# Altium schematic sheet Microcontroller.SchDoc: Microcontroller
size A4; SheetNumber: 4; SheetTotal: 7
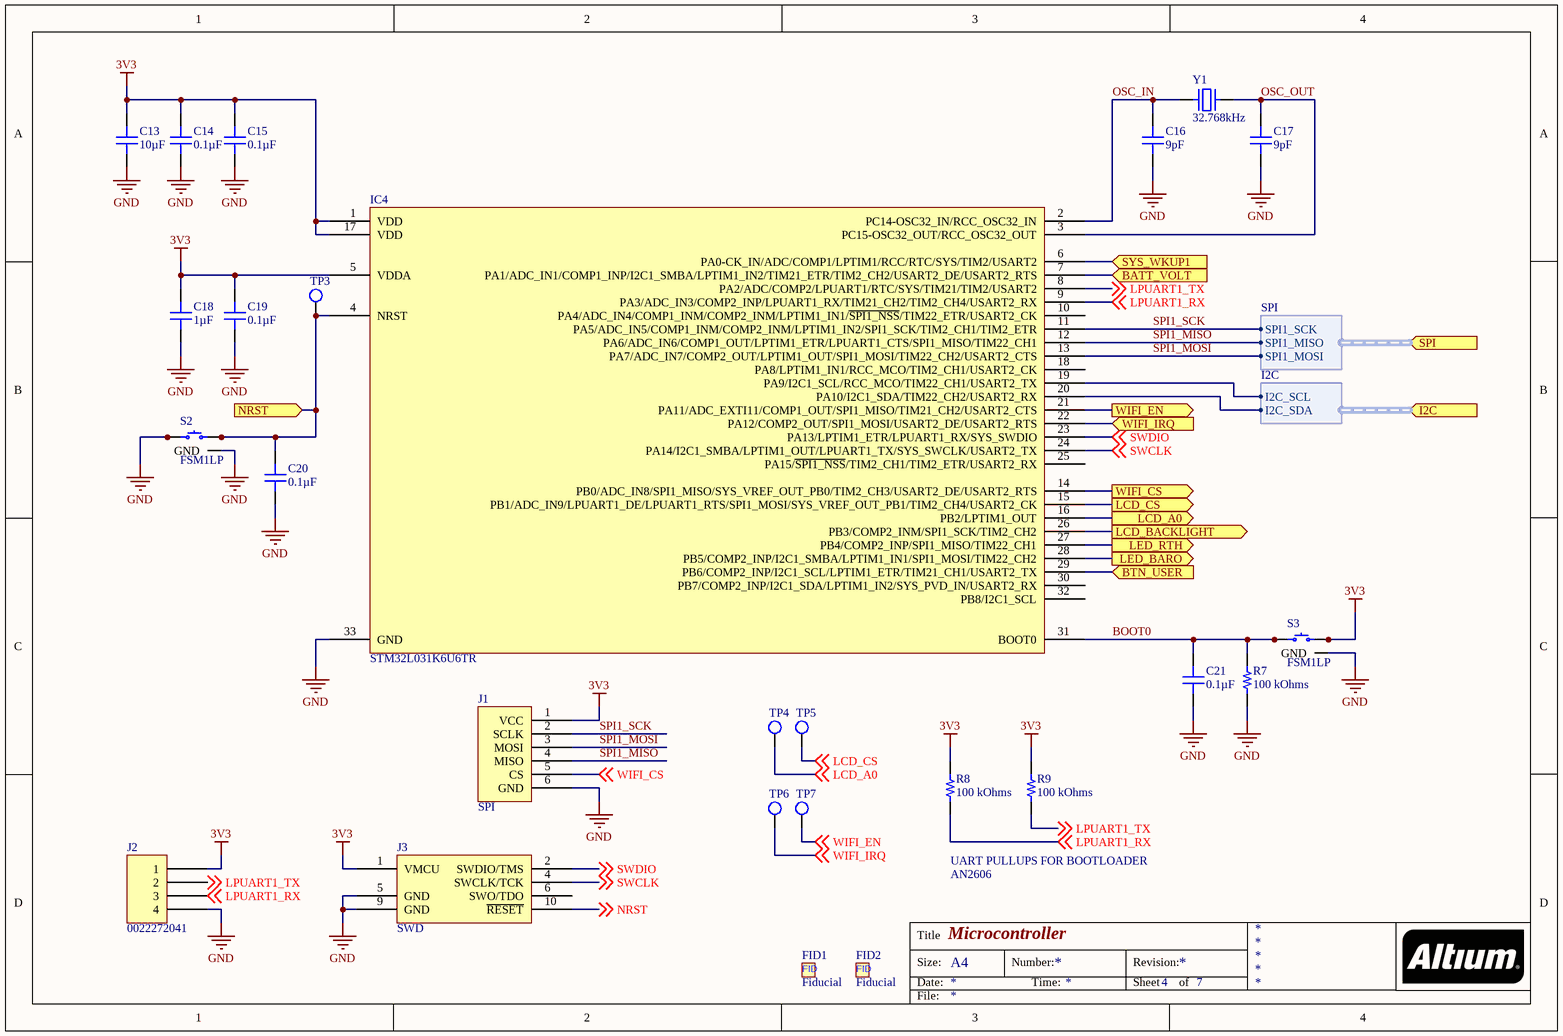
[diagram p0: Microcontroller.SchDoc]

## Parts
C13  10µF  [CAP 0805_2012]
C14  0.1µF  [CAP 0603_1608]
C15  0.1µF  [CAP 0603_1608]
C16  9pF  [CAP 0603_1608]
C17  9pF  [CAP 0603_1608]
C18  1µF  [CAP 0603_1608]
C19  0.1µF  [CAP 0603_1608]
C20  0.1µF  [CAP 0603_1608]
C21  0.1µF  [CAP 0603_1608]
FID1  Fiducial  [Fiducial-1mm]
FID2  Fiducial  [Fiducial-1mm]
IC4  STM32L031K6U6TR  [ST UFQFPN32 5x5MM]
J1  SPI  [SPI Breakout]
J2  0022272041  [MOLEX KK 0022272041]
J3  SWD  [10 Pin SWD]  (no BOM)
R7  100 kOhms  [RES 0603_1608]
R8  100 kOhms  [RES 0603_1608]
R9  100 kOhms  [RES 0603_1608]
S2  FSM1LP  [TE FSM1LPATR]
S3  FSM1LP  [TE FSM1LPATR]
TP3  Test Point  [TestPoint-1.5mm]  (value not drawn)  (no BOM)
TP4  Test Point  [TestPoint-1.5mm]  (value not drawn)  (no BOM)
TP5  Test Point  [TestPoint-1.5mm]  (value not drawn)  (no BOM)
TP6  Test Point  [TestPoint-1.5mm]  (value not drawn)  (no BOM)
TP7  Test Point  [TestPoint-1.5mm]  (value not drawn)  (no BOM)
Y1  32.768kHz  [ABRACON ABS07]

## Ports
BATT_VOLT (in), BTN_USER (in), I2C (in, harness I2C), LCD_A0 (out), LCD_BACKLIGHT (out), LCD_CS (out), LED_BARO (out), LED_RTH (out), NRST (in), SPI (in, harness SPI), SYS_WKUP1 (in), WIFI_CS (out), WIFI_EN (out), WIFI_IRQ (in)

## Harnesses
SPI: SPI1_MISO, SPI1_MOSI, SPI1_SCK
I2C: I2C_SDA, I2C_SCL

## Nets
3V3: C13.2 C14.2 C15.2 C18.2 C19.2 IC4.1(VDD) IC4.5(VDDA) IC4.17(VDD) J1.1(VCC) J2.1 J3.1(VMCU) R8.2 R9.2 S3.3 S3.4
GND: C13.1 C14.1 C15.1 C16.1 C17.1 C18.1 C19.1 C20.1 C21.1 IC4.33(GND) J1.6(GND) J2.4 J3.5(GND) J3.9(GND) R7.1 S2.1 S2.2 S2.5(GND) S3.5(GND)
BATT_VOLT: IC4.7(PA1/ADC_IN1/COMP1_INP/I2C1_SMBA/LPTIM1_IN2/TIM21_ETR/TIM2_CH2/USART2_DE/USART2_RTS) ; port BATT_VOLT
BOOT0: C21.2 IC4.31(BOOT0) R7.2 S3.1 S3.2
BTN_USER: IC4.29(PB6/COMP2_INP/I2C1_SCL/LPTIM1_ETR/TIM21_CH1/USART2_TX) ; port BTN_USER
LCD_A0: IC4.16(PB2/LPTIM1_OUT) ; port LCD_A0
LCD_A0: TP4.1(TP) ; off-sheet LCD_A0  [a separate net that carries the same name]
LCD_BACKLIGHT: IC4.26(PB3/COMP2_INM/SPI1_SCK/TIM2_CH2) ; port LCD_BACKLIGHT
LCD_CS: IC4.15(PB1/ADC_IN9/LPUART1_DE/LPUART1_RTS/SPI1_MOSI/SYS_VREF_OUT_PB1/TIM2_CH4/USART2_CK) ; port LCD_CS
LCD_CS: TP5.1(TP) ; off-sheet LCD_CS  [a separate net that carries the same name]
LED_BARO: IC4.28(PB5/COMP2_INP/I2C1_SMBA/LPTIM1_IN1/SPI1_MOSI/TIM22_CH2) ; port LED_BARO
LED_RTH: IC4.27(PB4/COMP2_INP/SPI1_MISO/TIM22_CH1) ; port LED_RTH
LPUART1_RX: IC4.9(PA3/ADC_IN3/COMP2_INP/LPUART1_RX/TIM21_CH2/TIM2_CH4/USART2_RX) J2.3 R8.1 ; off-sheet LPUART1_RX
LPUART1_TX: IC4.8(PA2/ADC/COMP2/LPUART1/RTC/SYS/TIM21/TIM2/USART2) J2.2 R9.1 ; off-sheet LPUART1_TX
NRST: C20.2 IC4.4(NRST) S2.3 S2.4 TP3.1(TP) ; port NRST
NRST: J3.10(~{RESET}) ; off-sheet NRST  [a separate net that carries the same name]
OSC_IN: C16.2 IC4.2(PC14-OSC32_IN/RCC_OSC32_IN) Y1.1
OSC_OUT: C17.2 IC4.3(PC15-OSC32_OUT/RCC_OSC32_OUT) Y1.2
SPI1_MISO: IC4.12(PA6/ADC_IN6/COMP1_OUT/LPTIM1_ETR/LPUART1_CTS/SPI1_MISO/TIM22_CH1) J1.4(MISO) ; port SPI.SPI1_MISO
SPI1_MOSI: IC4.13(PA7/ADC_IN7/COMP2_OUT/LPTIM1_OUT/SPI1_MOSI/TIM22_CH2/USART2_CTS) J1.3(MOSI) ; port SPI.SPI1_MOSI
SPI1_SCK: IC4.11(PA5/ADC_IN5/COMP1_INM/COMP2_INM/LPTIM1_IN2/SPI1_SCK/TIM2_CH1/TIM2_ETR) J1.2(SCLK) ; port SPI.SPI1_SCK
SWCLK: IC4.24(PA14/I2C1_SMBA/LPTIM1_OUT/LPUART1_TX/SYS_SWCLK/USART2_TX) J3.4(SWCLK/TCK) ; off-sheet SWCLK
SWDIO: IC4.23(PA13/LPTIM1_ETR/LPUART1_RX/SYS_SWDIO) J3.2(SWDIO/TMS) ; off-sheet SWDIO
SYS_WKUP1: IC4.6(PA0-CK_IN/ADC/COMP1/LPTIM1/RCC/RTC/SYS/TIM2/USART2) ; port SYS_WKUP1
WIFI_CS: IC4.14(PB0/ADC_IN8/SPI1_MISO/SYS_VREF_OUT_PB0/TIM2_CH3/USART2_DE/USART2_RTS) ; port WIFI_CS
WIFI_CS: J1.5(CS) ; off-sheet WIFI_CS  [a separate net that carries the same name]
WIFI_EN: IC4.21(PA11/ADC_EXTI11/COMP1_OUT/SPI1_MISO/TIM21_CH2/USART2_CTS) ; port WIFI_EN
WIFI_EN: TP7.1(TP) ; off-sheet WIFI_EN  [a separate net that carries the same name]
WIFI_IRQ: IC4.22(PA12/COMP2_OUT/SPI1_MOSI/USART2_DE/USART2_RTS) ; port WIFI_IRQ
WIFI_IRQ: TP6.1(TP) ; off-sheet WIFI_IRQ  [a separate net that carries the same name]
NetIC4_19: IC4.19(PA9/I2C1_SCL/RCC_MCO/TIM22_CH1/USART2_TX) ; port I2C.I2C_SCL
NetIC4_20: IC4.20(PA10/I2C1_SDA/TIM22_CH2/USART2_RX) ; port I2C.I2C_SDA

Not connected (* = marked no-connect by the designer): IC4 10(PA4/ADC_IN4/COMP1_INM/COMP2_INM/LPTIM1_IN1/~{SPI1_NSS}/TIM22_ETR/USART2_CK) 18(PA8/LPTIM1_IN1/RCC_MCO/TIM2_CH1/USART2_CK) 25(PA15/~{SPI1_NSS}/TIM2_CH1/TIM2_ETR/USART2_RX) 30(PB7/COMP2_INP/I2C1_SDA/LPTIM1_IN2/SYS_PVD_IN/USART2_RX) 32(PB8/I2C1_SCL); J3 6(SWO/TDO)

## Notes on the sheet
- UART PULLUPS FOR BOOTLOADER
- AN2606
- Title
- Size:
- Date:
- A4
- Number:
- Time:
- Revision:
- Sheet
- of
- File:
- (in symbol Fiducial) FID

## Library data of the parts
C13 = CL21A106KPCLQNC: CAP CER 10UF 10V X5R 0805; Manufacturer: Samsung Electro-Mechanics; Tolerance: ±10%; Part Number: CL21A106KPCLQNC; Value: 10µF; Applications: General Purpose; Capacitance: 10µF; ComponentLink1Description: Datasheet; ComponentLink1URL: http://www.samsungsem.com/kr/support/product-search/mlcc/CL21A106KPCLQNC.jsp; ComponentLink2Description: DigiKey Link; ComponentLink2URL: http://digikey.com/product-detail/en/samsung-electro-mechanics/CL21A106KPCLQNC/1276-2402-1-ND/3890488; Device Package: 0805 (2012 Metric); LastUpdated: 02/09/2020 01:04:19; Lifecycle Status: Active; Minimum Order: 1; Mounting Type: Surface Mount, MLCC; Operating Temperature: -55°C ~ 85°C; Package / Case: 0805 (2012 Metric); Packaging: TapeAndReel; PartId: 14319; Part Status: Active; Price: 0.03; Series: CL; Size / Dimension: 0.079" L x 0.049" W (2.00mm x 1.25mm); Supplier 1: DigiKey; Supplier Part Number 1: 1276-2402-1-ND; Temperature Coefficient: X5R; Thickness (Max): 0.037" (0.95mm); Voltage - Rated: 10V
C14 C15 C19-C21 = 06035C104JAT4A: CAP CER 0.1UF 50V X7R 0603; Manufacturer: AVX Corporation; Tolerance: ±5%; Part Number: 06035C104JAT4A; Value: 0.1µF; Applications: General Purpose; Capacitance: 0.1µF; ComponentLink1Description: Datasheet; ComponentLink1URL: http://datasheets.avx.com/X7RDielectric.pdf; ComponentLink2Description: DigiKey Link; ComponentLink2URL: http://digikey.com/product-detail/en/avx-corporation/06035C104JAT4A/478-12459-1-ND/9749311; Device Package: 0603 (1608 Metric); LastUpdated: 02/09/2020 01:03:34; Lifecycle Status: Active; Minimum Order: 1; Mounting Type: Surface Mount, MLCC; Operating Temperature: -55°C ~ 125°C; Package / Case: 0603 (1608 Metric); Packaging: TapeAndReel; PartId: 3002; Part Status: Active; Price: 0.01; Series: -; Size / Dimension: 0.063" L x 0.032" W (1.60mm x 0.81mm); Supplier 1: DigiKey; Supplier Part Number 1: 478-12459-1-ND; Temperature Coefficient: X7R; Thickness (Max): 0.035" (0.90mm); Voltage - Rated: 50V
C16 C17 = CL10C090CB8NNNC: CAP CER 9PF 50V C0G/NP0 0603; Manufacturer: Samsung Electro-Mechanics; Temperature Coefficient: C0G, NP0; Tolerance: ±0.25pF; Part Number: CL10C090CB8NNNC; Value: 9pF; Applications: General Purpose; Capacitance: 9pF; ComponentLink1Description: Datasheet; ComponentLink1URL: http://www.samsungsem.com/kr/support/product-search/mlcc/CL10C090CB8NNNC.jsp; ComponentLink2Description: DigiKey Link; ComponentLink2URL: http://digikey.com/product-detail/en/samsung-electro-mechanics/CL10C090CB8NNNC/1276-2142-1-ND/3890228; Device Package: 0603 (1608 Metric); LastUpdated: 02/09/2020 01:03:13; Lifecycle Status: Active; Minimum Order: 1; Mounting Type: Surface Mount, MLCC; Operating Temperature: -55°C ~ 125°C; Package / Case: 0603 (1608 Metric); Packaging: TapeAndReel; PartId: 14182; Part Status: Active; Price: 0.01; Series: CL; Size / Dimension: 0.063" L x 0.031" W (1.60mm x 0.80mm); Supplier 1: DigiKey; Supplier Part Number 1: 1276-2142-1-ND; Thickness (Max): 0.035" (0.90mm); Voltage - Rated: 50V
C18 = LMK107B7105KA-T: CAP CER 1UF 10V X7R 0603; Manufacturer: Taiyo Yuden; Tolerance: ±10%; Part Number: LMK107B7105KA-T; Value: 1µF; Applications: General Purpose; Capacitance: 1µF; ComponentLink1Description: Datasheet; ComponentLink1URL: https://www.yuden.co.jp/productdata/catalog/mlcc01_e.pdf; ComponentLink2Description: DigiKey Link; ComponentLink2URL: http://digikey.com/product-detail/en/taiyo-yuden/LMK107B7105KA-T/587-1242-1-ND/931019; Device Package: 0603 (1608 Metric); LastUpdated: 02/09/2020 01:03:30; Lifecycle Status: Active; Minimum Order: 1; Mounting Type: Surface Mount, MLCC; Operating Temperature: -55°C ~ 125°C; Package / Case: 0603 (1608 Metric); Packaging: TapeAndReel; PartId: 5525; Part Status: Active; Price: 0.01; Series: M; Size / Dimension: 0.063" L x 0.031" W (1.60mm x 0.80mm); Supplier 1: DigiKey; Supplier Part Number 1: 587-1242-1-ND; Temperature Coefficient: X7R; Thickness (Max): 0.035" (0.90mm); Voltage - Rated: 10V
IC4 = STM32L031K6U6TR: IC MCU 32BIT 32KB FLASH 32UFQFPN; Manufacturer: STMicroelectronics; Connectivity: I²C, IrDA, LINbus, SPI, UART/USART; Core Processor: ARM® Cortex®-M0+; Core Size: 32-Bit; Data Converters: A/D 10x12b; EEPROM Size: 1K x 8; Number of I/O: 27; Oscillator Type: Internal; Peripherals: Brown-out Detect/Reset, DMA, POR, PWM, WDT; Program Memory Size: 32KB (32K x 8); RAM Size: 8K x 8; Speed: 32MHz; Voltage - Supply (Vcc/Vdd): 1.8V ~ 3.6V; Part Number: STM32L031K6U6TR; ComponentLink1Description: Datasheet; ComponentLink1URL: http://www.st.com/content/ccc/resource/technical/document/datasheet/aa/5d/77/ad/1a/59/4a/b9/DM00140359.pdf/files/DM00140359.pdf/jcr:content/translations/en.DM00140359.pdf; ComponentLink2Description: DigiKey Link; ComponentLink2URL: http://digikey.com/product-detail/en/stmicroelectronics/STM32L031K6U6TR/497-18807-1-ND/9958467; LastUpdated: 18/01/2022 11:56:57; Lifecycle Status: Active; Minimum Order: 1; Mounting Type: Surface Mount; Operating Temperature: -40°C ~ 85°C (TA); Package / Case: 32-UFQFN Exposed Pad; Packaging: TapeAndReel; PartId: 225; Part Status: Active; Price: 1.15; Program Memory Type: FLASH; Series: STM32L0; Supplier 1: DigiKey; Supplier Part Number 1: 497-18807-1-ND; Supplier Device Package: 32-UFQFPN (5x5)
J2 = 0022272041: CONN HEADER VERT 4POS 2.54MM; Manufacturer: Molex; Contact Length - Mating: 0.295" (7.49mm); Contact Length - Post: 0.140" (3.56mm); Material Flammability Rating: UL94 V-0; Number of Positions: 4; Number of Positions Loaded: All; Overall Contact Length: 0.560" (14.22mm); Pitch - Mating: 0.100" (2.54mm); Shrouding: Shrouded - 1 Wall; Style: Board to Cable/Wire; Part Number: 0022272041; ComponentLink1Description: Datasheet; ComponentLink1URL: https://www.molex.com/pdm_docs/sd/022272041_sd.pdf; ComponentLink2Description: DigiKey Link; ComponentLink2URL: http://digikey.com/product-detail/en/molex/0022272041/WM4113-ND/1130579; Connector Type: Header; Contact Finish - Mating: Tin; Contact Finish - Post: Tin; Contact Finish Thickness - Mating: 100.0µin (2.54µm); Contact Material: Brass; Contact Shape: Square; Contact Type: Male Pin; Fastening Type: Friction Lock; Insulation Color: Natural; Insulation Height: 0.461" (11.70mm); Insulation Material: Polyamide (PA), Nylon; LastUpdated: 12/01/2020 23:52:05; Lifecycle Status: Active; Minimum Order: 1; Mounting Type: Through Hole; Number of Rows: 1; Packaging: Bulk; PartId: 78; Part Status: Active; Price: 0.40; Series: KK 6410; Supplier 1: DigiKey; Supplier Part Number 1: WM4113-ND; Termination: Solder
R7-R9 = ERJ-PA3J104V: RES SMD 100K OHM 5% 1/4W 0603; Manufacturer: Panasonic Electronic Components; Power (Watts): 0.25W, 1/4W; Temperature Coefficient: ±200ppm/°C; Part Number: ERJ-PA3J104V; Value: 100 kOhms; ComponentLink1Description: Datasheet; ComponentLink1URL: https://industrial.panasonic.com/cdbs/www-data/pdf/RDO0000/AOA0000C331.pdf; ComponentLink2Description: DigiKey Link; ComponentLink2URL: http://digikey.com/product-detail/en/panasonic-electronic-components/ERJ-PA3J104V/P100KBZCT-ND/5036238; Composition: Thick Film; Device Package: 0603 (1608 Metric); Features: Automotive AEC-Q200, Pulse Withstanding; Height - Seated (Max): 0.022" (0.55mm); LastUpdated: 02/09/2020 01:10:15; Lifecycle Status: Active; Minimum Order: 1; Number of Terminations: 2; Operating Temperature: -55°C ~ 155°C; Package / Case: 0603 (1608 Metric); Packaging: TapeAndReel; PartId: 9671; Part Status: Active; Price: 0.01; Ratings: AEC-Q200; Resistance: 100 kOhms; Series: ERJ; Size / Dimension: 0.063" L x 0.031" W (1.60mm x 0.80mm); Supplier 1: DigiKey; Supplier Part Number 1: P100KBZCT-ND; Supplier Device Package: 0603; Tolerance: ±5%
S2 S3 = FSM1LP: SWITCH TACTILE SPST-NO 0.05A 24V; Manufacturer: TE Connectivity ALCOSWITCH Switches; Actuator Height off PCB, Vertical: 3.10mm; Actuator Orientation: Top Actuated; Actuator Type: Standard; Contact Rating @ Voltage: 0.05A @ 24VDC; Illumination: Non-Illuminated; Operating Force: 160gf; Outline: 6.00mm x 6.00mm; Switch Function: Off-Mom; Part Number: FSM1LP; Circuit: SPST-NO; ComponentLink1Description: Datasheet; ComponentLink1URL: https://www.te.com/commerce/DocumentDelivery/DDEController?Action=srchrtrv&DocNm=1-1437565-8&DocType=Customer+Drawing&DocLang=English; ComponentLink2Description: DigiKey Link; ComponentLink2URL: http://digikey.com/product-detail/en/te-connectivity-alcoswitch-switches/FSM1LP/450-1132-ND/525816; Features: Grounding Pin; LastUpdated: 04/02/2020 14:40:32; Lifecycle Status: Active; Minimum Order: 1; Mounting Type: Surface Mount; Operating Temperature: -35°C ~ 85°C; Packaging: Bulk; Part Status: Active; Price: 0.51; Series: FSM1LP; Supplier 1: DigiKey; Supplier Part Number 1: 450-1132-ND; Termination Style: Gull Wing
Y1 = ABS07-166-32.768KHZ-T: IOT 32.786KHZ XTAL; Manufacturer: Abracon LLC; ESR (Equivalent Series Resistance): 70 kOhms; Frequency Tolerance: ±10ppm; Load Capacitance: 7pF; Operating Mode: Fundamental; Part Number: ABS07-166-32.768KHZ-T; ComponentLink1Description: Datasheet; ComponentLink1URL: https://abracon.com/datasheets/ABS07-166-32.768kHz-T.pdf; ComponentLink2Description: DigiKey Link; ComponentLink2URL: http://digikey.com/product-detail/en/abracon-llc/ABS07-166-32.768KHZ-T/535-14514-1-ND/8827205; Frequency: 32.768kHz; Height - Seated (Max): 0.035" (0.90mm); LastUpdated: 02/09/2020 01:21:47; Lifecycle Status: Active; Minimum Order: 1; Mounting Type: Surface Mount; Operating Temperature: -40°C ~ 85°C; Package / Case: 2-SMD, No Lead; Packaging: TapeAndReel; PartId: 384; Part Status: Active; Price: 0.35; Series: ABS07; Size / Dimension: 0.126" L x 0.059" W (3.20mm x 1.50mm); Supplier 1: DigiKey; Supplier Part Number 1: 535-14514-1-ND; Type: kHz Crystal (Tuning Fork); Value: 32.768kHz